# Altium project holoboard_mezzanine.PrjPCB
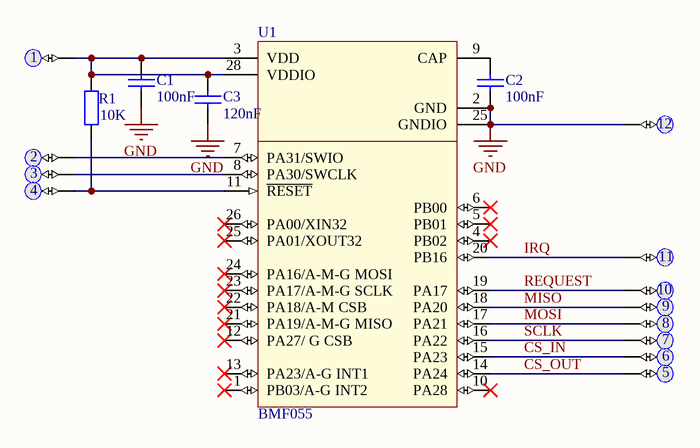
[diagram p0: Holoboard_mezzanine.SchDoc]
1 sheet, 17 parts. Net scope: global (net labels, ports and power ports of the same name join across sheets).
Board file: holoboard_mezzanine.PcbDoc

## Sheet Holoboard_mezzanine.SchDoc
size A4

### Parts
1  Pad  [PAD]  (value not drawn)
2  Pad  [PAD]  (value not drawn)
3  Pad  [PAD]  (value not drawn)
4  Pad  [PAD]  (value not drawn)
5  Pad  [PAD]  (value not drawn)
6  Pad  [PAD]  (value not drawn)
7  Pad  [PAD]  (value not drawn)
8  Pad  [PAD]  (value not drawn)
9  Pad  [PAD]  (value not drawn)
10  Pad  [PAD]  (value not drawn)
11  Pad  [PAD]  (value not drawn)
12  Pad  [PAD]  (value not drawn)
C1  value 100nF  [C0402]  (hidden comment: Cap)
C2  value 100nF  [C0402]  (hidden comment: Cap)
C3  value 120nF  [C0402]  (hidden comment: Cap)
R1  value 10K  [0402]  (hidden comment: Res2)
U1  BMF055  [LGA28]

### Nets
GND: 12.1(Pad) C1.2 C2.1 C3.1 U1.2(GND) U1.25(GNDIO)
CS_IN: 6.1(Pad) U1.15(PA23)
CS_OUT: 5.1(Pad) U1.14(PA24)
IRQ: 11.1(Pad) U1.20(PB16)
MISO: 9.1(Pad) U1.18(PA20)
MOSI: 8.1(Pad) U1.17(PA21)
REQUEST: 10.1(Pad) U1.19(PA17)
SCLK: 7.1(Pad) U1.16(PA22)
Net1_1: 1.1(Pad) C1.1 C3.2 R1.2 U1.3(VDD) U1.28(VDDIO)
Net2_1: 2.1(Pad) U1.7(PA31/SWIO)
Net3_1: 3.1(Pad) U1.8(PA30/SWCLK)
Net4_1: 4.1(Pad) R1.1 U1.11(~{RESET})
NetC2_2: C2.2 U1.9(CAP)

Not connected (* = marked no-connect by the designer): U1 1(PB03/A-G_INT2)* 4(PB02)* 5(PB01)* 6(PB00)* 10(PA28)* 12(PA27/_G_CSB)* 13(PA23/A-G_INT1)* 21(PA19/A-M-G_MISO)* 22(PA18/A-M_CSB)* 23(PA17/A-M-G_SCLK)* 24(PA16/A-M-G_MOSI)* 26(PA00/XIN32)*

### Library data of the parts
C1-C3 = Cap: Capacitor; Published: 8-Jun-2000; LatestRevisionDate: 17-Jul-2002; LatestRevisionNote: Re-released for DXP Platform.; PackageReference: RAD-0.3; Publisher: Altium Limited; Supplier: FARNELL
R1 = Res2: Resistor; Published: 8-Jun-2000; LatestRevisionDate: 17-Jul-2002; LatestRevisionNote: Re-released for DXP Platform.; PackageReference: AXIAL-0.4; Publisher: Altium Limited; Supplier: FARNELL